# Altium schematic sheet Stepper Motor4.SchDoc
size A2; SheetNumber: 7; SheetTotal: 9
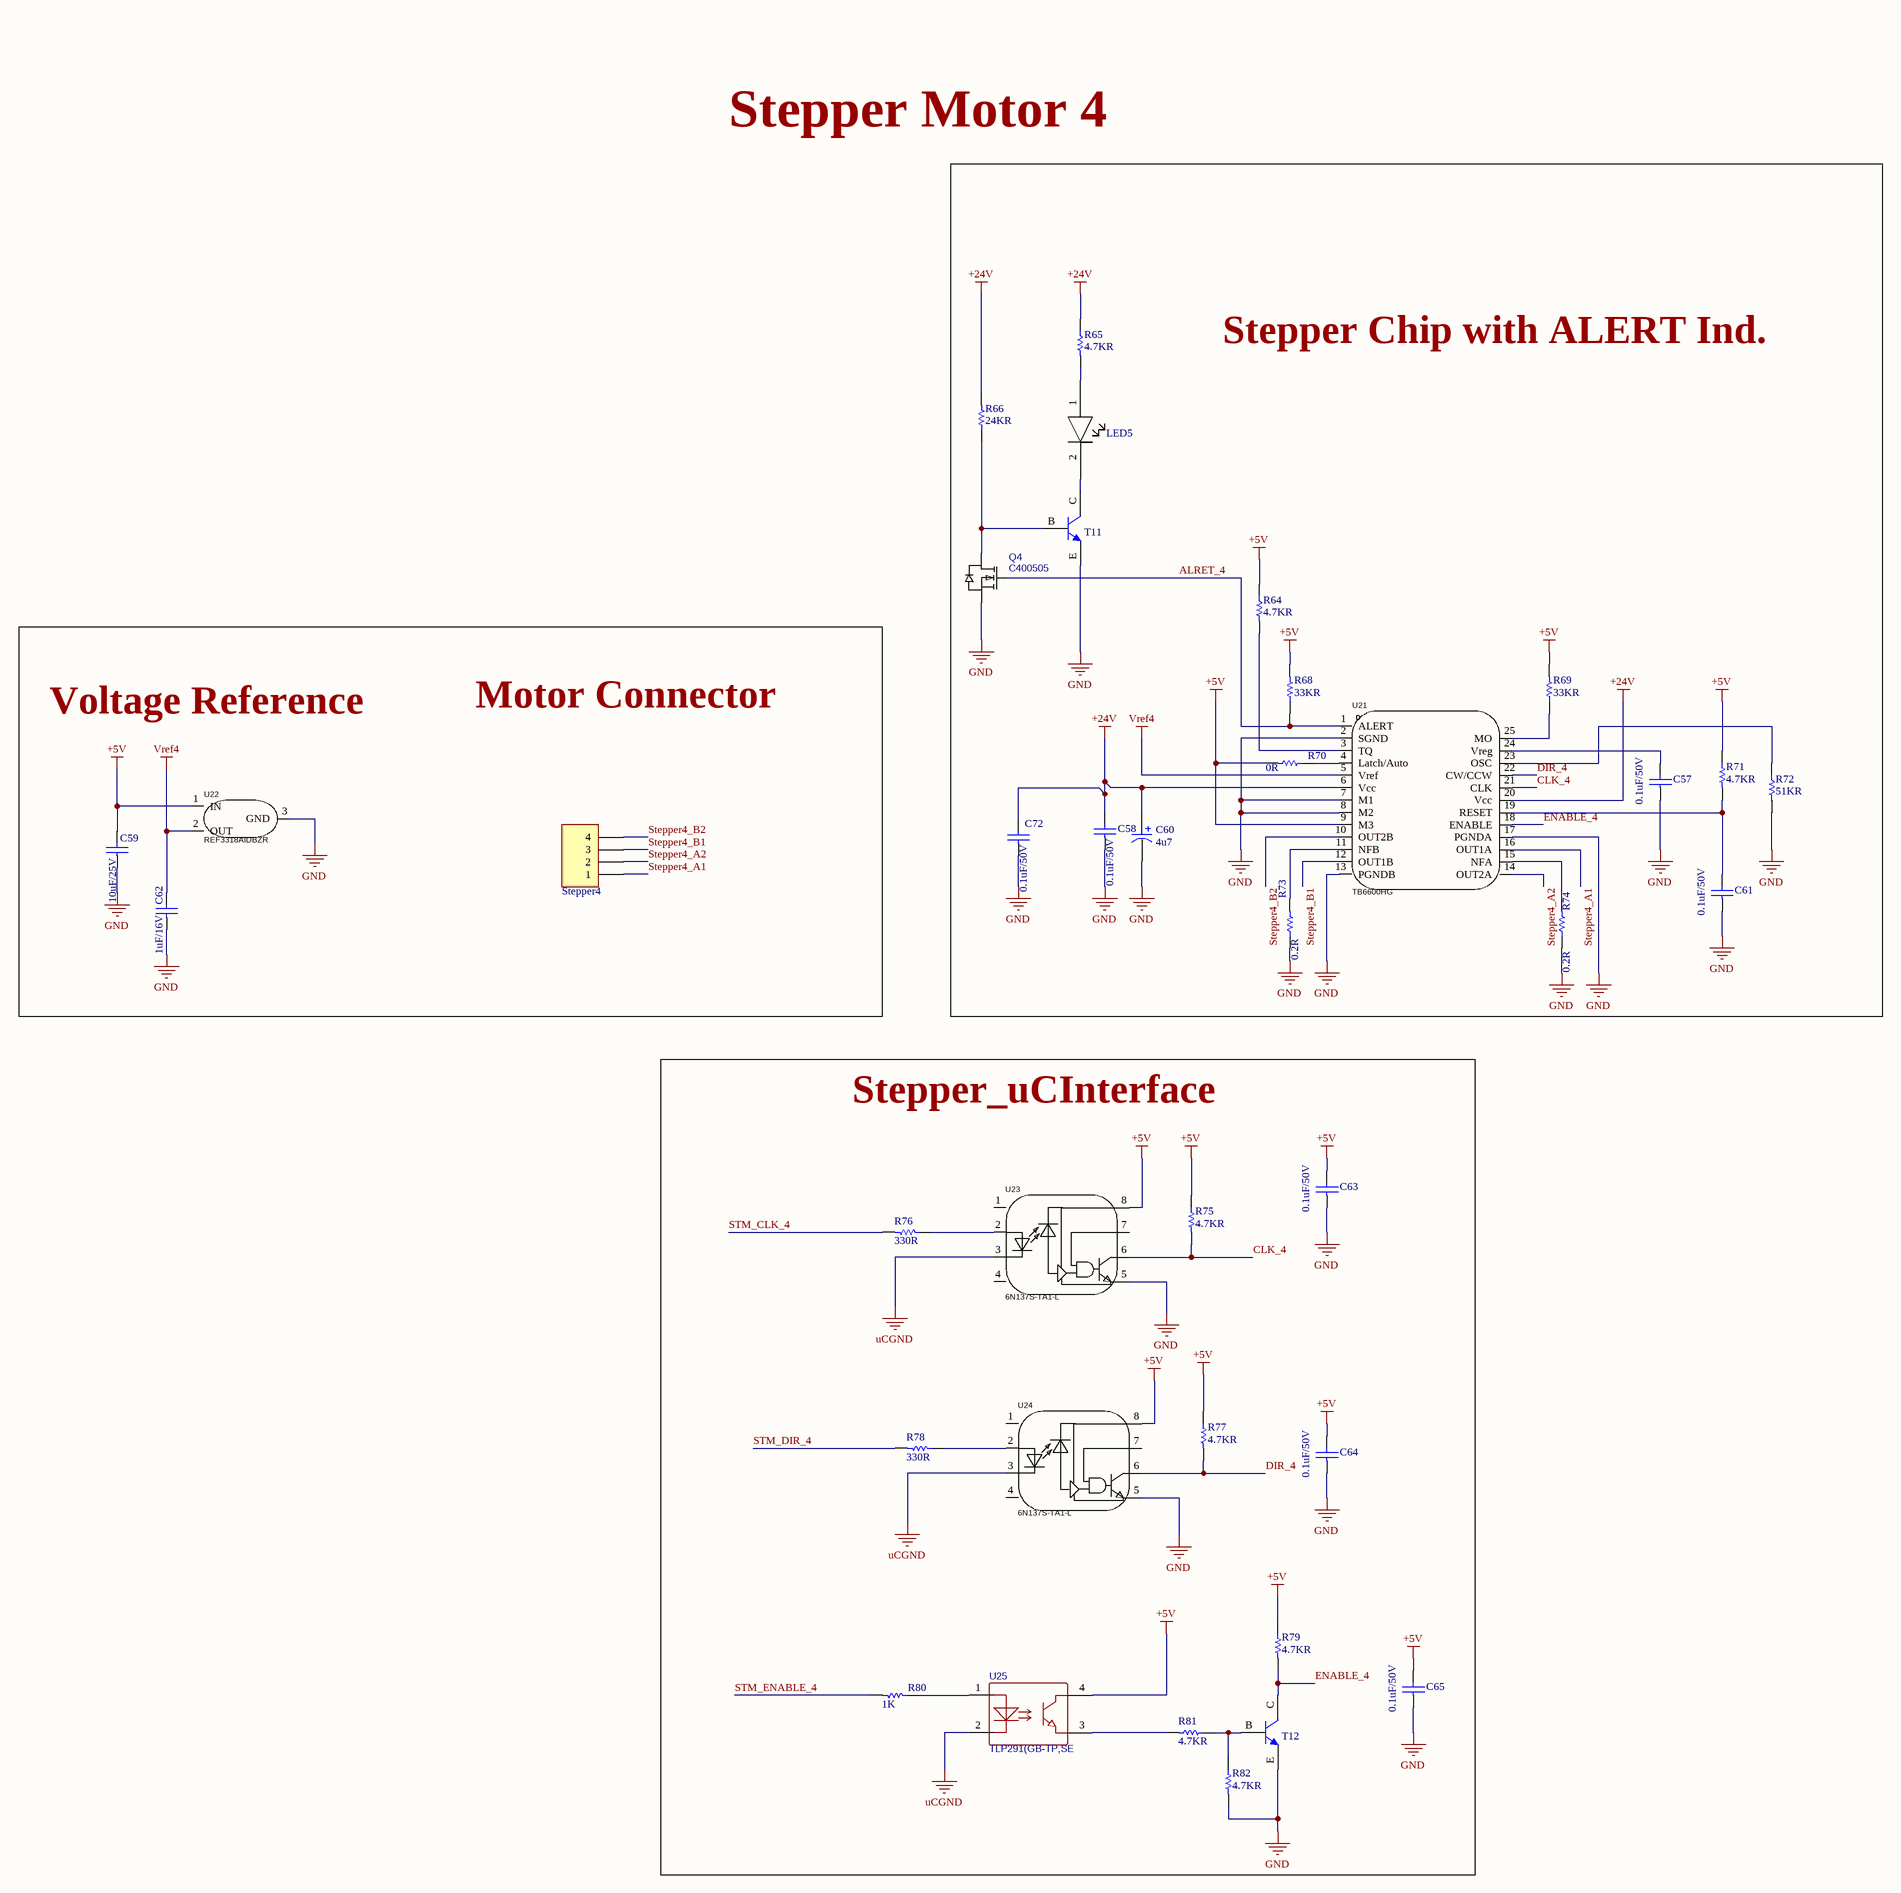
[diagram p0: Stepper Motor4.SchDoc]

## Parts
C57  0.1uF/50V  [PCBComponent_1]
C58  0.1uF/50V  [PCBComponent_1]
C59  10uF/25V  [PCBComponent_1]
C60  4u7  [CAPLEAD_D6.3mm]
C61  0.1uF/50V  [PCBComponent_1]
C62  1uF/16V  [PCBComponent_1]
C63  0.1uF/50V  [PCBComponent_1]
C64  0.1uF/50V  [PCBComponent_1]
C65  0.1uF/50V  [PCBComponent_1]
C72  0.1uF/50V  [PCBComponent_1]
LED5  1206 LED  [1206 LED]  (value not drawn)
Q4  C400505  [SOT-23-3_L2.9-W1.3-P1.90-LS2.4-BR]
R64  4.7KR  [R0402]
R65  4.7KR  [R0402]
R66  24KR  [RESC1608X06N]
R68  33KR  [RESC1608X06N]
R69  33KR  [RESC1608X06N]
R70  0R  [RESC1608X06N]
R71  4.7KR  [R0402]
R72  51KR  [R0402]
R73  0.2R  [RESC6431X12N]
R74  0.2R  [RESC6431X12N]
R75  4.7KR  [R0402]
R76  330R  [R0402]
R77  4.7KR  [R0402]
R78  330R  [R0402]
R79  4.7KR  [R0402]
R80  1K  [R0402]
R81  4.7KR  [R0402]
R82  4.7KR  [R0402]
Stepper4  Header 4 Pin Polar  [PCBComponent_1]  (value not drawn)
T11  MMBT3904 Transistor  [MMBT3904]  (value not drawn)
T12  MMBT3904 Transistor  [MMBT3904]  (value not drawn)
U21  TB6600HG  [HZIP25-P-1.0_TB6600HG - HEATSINK]
U22  REF3318AIDBZR  [SOT-23-3_L2.9-W1.3-P1.90-LS2.4-BR]
U23  6N137S-TA1-L  [SOP-8_L9.8-W6.6-P2.54-LS10.3-BL]
U24  6N137S-TA1-L  [SOP-8_L9.8-W6.6-P2.54-LS10.3-BL]
U25  TLP291(GB-TP,SE  [SOP-4-1.27mm]

## Blocks framed on the sheet
Stepper Chip with ALERT Ind.: C57 C58 C60 C61 C72 LED5 Q4 R64-R66 R68-R74 T11 U21
Stepper_uCInterface: C63-C65 R75-R82 T12 U23-U25

## Nets
+5V: C59.2 C63.2 C64.2 C65.2 R64.1 R68.2 R69.2 R70.2 R71.1 R75.1 R77.1 R79.1 U21.9(M3) U22.1(IN) U23.8 U24.8 U25.4
+24V: C58.2 C60.1 C72.2 R65.1 R66.2 U21.6(Vcc) U21.20(Vcc)
GND: C57.1 C58.1 C59.1 C60.2 C61.1 C62.1 C63.1 C64.1 C65.1 C72.1 Q4.2(S) R72.2 R73.1 R74.1 R82.2 T11.E T12.E U21.2(SGND) U21.7(M1) U21.8(M2) U21.13(PGNDB) U21.17(PGNDA) U22.3(GND) U23.5 U24.5
uCGND: U23.3 U24.3 U25.2
Vref4: C62.2 U21.5(Vref) U22.2(OUT)
ALRET_4: Q4.1(G) R68.1 U21.1(ALERT)
CLK_4: R75.2 U21.21(CLK) U23.6
DIR_4: R77.2 U21.22(CW/CCW) U24.6
ENABLE_4: R79.2 T12.C U21.18(ENABLE)
Stepper4_A1: Stepper4.1 U21.16(OUT1A)
Stepper4_A2: Stepper4.2 U21.14(OUT2A)
Stepper4_B1: Stepper4.3 U21.12(OUT1B)
Stepper4_B2: Stepper4.4 U21.10(OUT2B)
STM_CLK_4: R76.2
STM_DIR_4: R78.2
STM_ENABLE_4: R80.2
NetC57_2: C57.2 U21.24(Vreg)
NetC61_2: C61.2 R71.2 U21.19(RESET)
NetLED5_1: LED5.1 R65.2
NetLED5_2: LED5.2 T11.C
NetQ4_3: Q4.3(D) R66.1 T11.B
NetR64_2: R64.2 U21.3(TQ)
NetR69_1: R69.1 U21.25(MO)
NetR70_1: R70.1 U21.4(Latch/Auto)
NetR72_1: R72.1 U21.23(OSC)
NetR73_2: R73.2 U21.11(NFB)
NetR74_2: R74.2 U21.15(NFA)
NetR76_1: R76.1 U23.2
NetR78_1: R78.1 U24.2
NetR80_1: R80.1 U25.1
NetR81_1: R81.1 R82.1 T12.B
NetR81_2: R81.2 U25.3

Not connected (* = marked no-connect by the designer): U23 1(NC) 4(NC) 7; U24 1(NC) 4(NC) 7

## Notes on the sheet
- Stepper Motor 4
- Motor Connector
- Voltage Reference

## Library data of the parts
C57 C58 C61 C63-C65 C72 = 0603 Capacitor: C1591; Created By: NourAldin; DataSheet Link: https://eu.mouser.com/datasheet/2/400/lcc_automotive_general_en-843974.pdf; Mouser Link: https://eu.mouser.com/ProductDetail/TDK/CGA1A2X7R1H331M030BA?qs=sGAEpiMZZMs0AnBnWHyRQL8L3bkL%252bvtyS9XpSB1mk7rVV5K8%252bbxEeg%3d%3d
C59 = 0603 Capacitor: C96446; Created By: NourAldin; DataSheet Link: https://eu.mouser.com/datasheet/2/400/lcc_automotive_general_en-843974.pdf; Mouser Link: https://eu.mouser.com/ProductDetail/TDK/CGA1A2X7R1H331M030BA?qs=sGAEpiMZZMs0AnBnWHyRQL8L3bkL%252bvtyS9XpSB1mk7rVV5K8%252bbxEeg%3d%3d
C60 = A759EQ475M2AAAE160: C2691843; Manufacturer: KEMET; Supplier 1: Mouser; Manufacturer Part Number: A759EQ475M2AAAE160; RoHS: Yes; Category: Polymer Capacitors; Stock 1: 17219; Pricing 1: 1=0.97, 10=0.73, 50=0.73, 100=0.546, 1000=0.384, 10000=0.326 (USD); ComponentLink1URL: http://www.kemet.com/docfinder?Partnumber=A759EQ475M2AAAE160&src-supplier=Digikey; ComponentLink1Description: http://www.kemet.com/docfinder?Partnumber=A759EQ475M2AAAE160&src-supplier=Digikey; ComponentLink2URL: http://www.farnell.com/datasheets/2095614.pdf?src-supplier=Element14; ComponentLink2Description: http://www.farnell.com/datasheets/2095614.pdf?src-supplier=Element14; Supplier Part Number 1: 80-A759EQ475M2AAE160
C62 = 0603 Capacitor: C1592; Created By: NourAldin; DataSheet Link: https://eu.mouser.com/datasheet/2/400/lcc_automotive_general_en-843974.pdf; Mouser Link: https://eu.mouser.com/ProductDetail/TDK/CGA1A2X7R1H331M030BA?qs=sGAEpiMZZMs0AnBnWHyRQL8L3bkL%252bvtyS9XpSB1mk7rVV5K8%252bbxEeg%3d%3d
LED5 = 1206 LED: C434438; Created By: NourAldin
Q4 = BSS138_MOSFET: Manufacturer: YANGJIE(扬杰); Manufacturer Part: BSS138; Contributor: LCSC; Supplier: LCSC; Supplier Part: C400505; JLCPCB Part Class: Extended Part; spicePre: Q; spiceSymbolName: BSS138_C400505
R64 R65 R71 R75 R77 R79 R81 R82 = 0402 Resistor: C105871
R66 = 0603 Resistor: C2930081; Created By: NourAldin; Mouser Link: https://eu.mouser.com/ProductDetail/Panasonic/ERA-3AHD180V?qs=sGAEpiMZZMvdGkrng054t5mej2KPdPuFSlDBd1tSiF0%3d; DataSheet Link: https://eu.mouser.com/datasheet/2/315/AOA0000C307-1149632.pdf
R68 R69 = 0603 Resistor: C126359; Created By: NourAldin; Mouser Link: https://eu.mouser.com/ProductDetail/Panasonic/ERA-3AHD180V?qs=sGAEpiMZZMvdGkrng054t5mej2KPdPuFSlDBd1tSiF0%3d; DataSheet Link: https://eu.mouser.com/datasheet/2/315/AOA0000C307-1149632.pdf
R70 = 0603 Resistor: C100044; Created By: NourAldin; Mouser Link: https://eu.mouser.com/ProductDetail/Panasonic/ERA-3AHD180V?qs=sGAEpiMZZMvdGkrng054t5mej2KPdPuFSlDBd1tSiF0%3d; DataSheet Link: https://eu.mouser.com/datasheet/2/315/AOA0000C307-1149632.pdf
R72 = 0402 Resistor: C107230
R73 R74 = 2512 Resistor: C2903473; Created By: NourAldin; Mouser Link: https://eu.mouser.com/ProductDetail/Bourns/CSS2H-2512K-2L00F?qs=sGAEpiMZZMukHu%252bjC5l7YewuupLM8jZrvWs15Y6t0rY%3D&fbclid=IwAR0ZD_uc1Y03YG_KyYG8NxrpBzYgFzVeevvjxrlqtGWJ1HKz-jrYfqlFWCw; DataSheet Link: https://eu.mouser.com/datasheet/2/54/ss2h-2512-1302652.pdf
R76 R78 = 0402 Resistor: C105875
R80 = 0402 Resistor: C106235
Stepper4 = Header 4 Pin Polar: C144395
T11 T12 = MMBT3904 Transistor: C108429; Created By: NourAldin
U21 = TB6600HG: C66042; Manufacturer: TOSHIBA(东芝); Add into BOM: yes; Symbol: TB6600HG; Device: TB6600HG; LCSC Part Name: 4.5A 42V电机驱动芯片; Supplier Part: C66042; Manufacturer Part: TB6600HG; Supplier Footprint: HZIP-25-P-1mm; JLCPCB Part Class: Extended Part; Datasheet: https://atta.szlcsc.com/upload/public/pdf/source/20170511/1494500127812.pdf; Supplier: LCSC; Convert to PCB: yes
U22 = REF3318AIDBZR: C115877; Manufacturer: TI(德州仪器); Add into BOM: yes; Output Type: Fixed; Input Voltage: 2V~5.5V; Output Voltage: 1.8V; Output Current: 5mA; Tolerance: ±0.15%; Temperature Coefficient: 30ppm/℃; Reference Type: series connection; Supply Current: 8.5uA; Noise - 1/10Hz to 10Hz: 50uVp-p; Symbol: REF3318AIDBZR; Device: REF3318AIDBZR; LCSC Part Name: REF3318AIDBZR; Supplier Part: C115877; Manufacturer Part: REF3318AIDBZR; Supplier Footprint: SOT-23; JLCPCB Part Class: Extended Part; Datasheet: https://www.ti.com/cn/lit/gpn/ref3318; Supplier: LCSC; Convert to PCB: yes; Noise - 10Hz to 10kHz: -; Operating Temperature: -40℃~+125℃@(Ta)
U23 U24 = 6N137S-TA1-L: C92651; Manufacturer: LITEON(光宝); Add into BOM: yes; Input Type: DC; Supply Voltage: 4.5V~5.5V; Common Mode Transient Immunity (CMTI): 10kV/us; Data Rate: 15Mbit/s; Propagation Delay tpLH/tpHL: 32ns；40ns; Number of Channels: 1; Symbol: 6N137S-TA1; Device: 6N137S-TA1-L; LCSC Part Name: DC输入 1通道; Supplier Part: C92651; Manufacturer Part: 6N137S-TA1-L; Supplier Footprint: SOP-8-2.54mm; JLCPCB Part Class: Extended Part; Datasheet: https://atta.szlcsc.com/upload/public/pdf/source/20191018/C92651_D1F9F6F1F10C7EC7C3739E5ECB700036.pdf; Supplier: LCSC; Convert to PCB: yes; Operating Temperature: -40℃~+85℃
U25 = TLP291(GB-TP,SE(T: C55144; BOM_Manufacturer: TOSHIBA(东芝); BOM_Supplier: LCSC; Manufacturer Part Number: TLP291(GB-TP,SE; Supplier Part Number 2: C55144; BOM_JLCPCB Part Class: Extended Part; LCSC Link: https://www.lcsc.com/product-detail/Optocouplers-Phototransistor-Output_TOSHIBA-TLP291-GB-TP-SE_C55144.html; spiceSymbolName: TLP291(GB-TP,SE(T